# Altium project ife18_TS_BMS_LTC6813_v2.PrjPcb
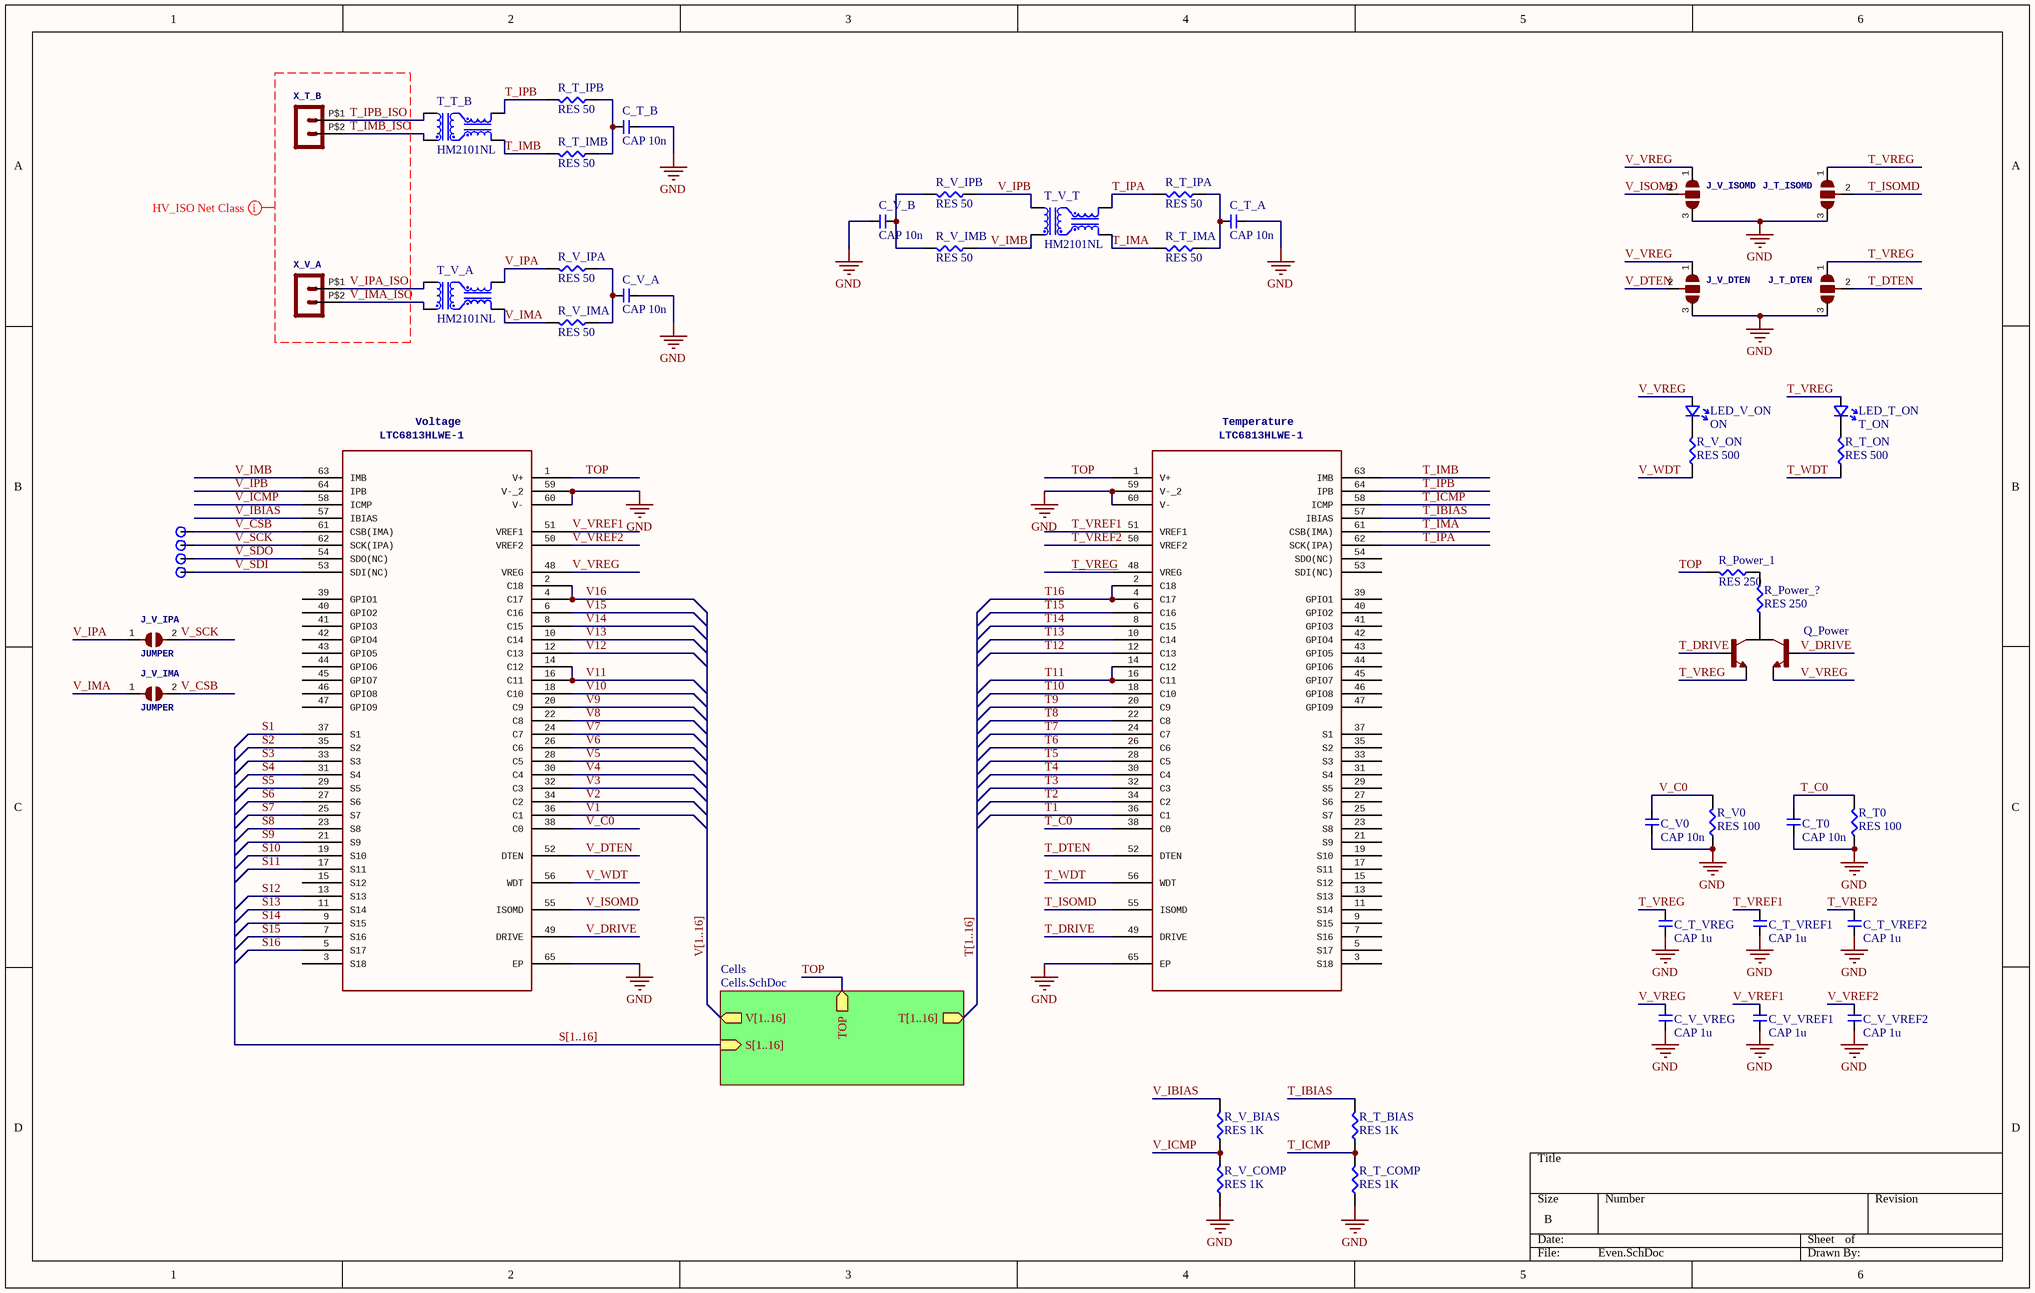
[diagram p0: Even.SchDoc]
3 sheets, 242 parts. Net scope: hierarchical (ports join the sheet entries above them; power ports are global).
Board file: ife18_TS_BMS_LTC6813_v2.PcbDoc
Sheets:
  Even.SchDoc
    Cells = Cells.SchDoc
      CELL1 = Cell.SchDoc
      CELL2 = Cell.SchDoc
      CELL3 = Cell.SchDoc
      CELL4 = Cell.SchDoc
      CELL5 = Cell.SchDoc
      CELL6 = Cell.SchDoc
      CELL7 = Cell.SchDoc
      CELL8 = Cell.SchDoc
      CELL9 = Cell.SchDoc
      CELL10 = Cell.SchDoc
      CELL11 = Cell.SchDoc
      CELL12 = Cell.SchDoc
      CELL13 = Cell.SchDoc
      CELL14 = Cell.SchDoc
      CELL15 = Cell.SchDoc
      CELL16 = Cell.SchDoc

## Sheet Even.SchDoc
size B

### Parts
C_T0  CAP 10n  [CAP-0603]
C_T_A  CAP 10n  [CAP-0603]
C_T_B  CAP 10n  [CAP-0603]
C_T_VREF1  CAP 1u  [CAP-0603]
C_T_VREF2  CAP 1u  [CAP-0603]
C_T_VREG  CAP 1u  [CAP-0603]
C_V0  CAP 10n  [CAP-0603]
C_V_A  CAP 10n  [CAP-0603]
C_V_B  CAP 10n  [CAP-0603]
C_V_VREF1  CAP 1u  [CAP-0603]
C_V_VREF2  CAP 1u  [CAP-0603]
C_V_VREG  CAP 1u  [CAP-0603]
J_T_DTEN  (no value)  [SJ_2]
J_T_ISOMD  (no value)  [SJ_2]
J_V_DTEN  (no value)  [SJ_2]
J_V_IMA  JUMPER  [SJ]
J_V_IPA  JUMPER  [SJ]
J_V_ISOMD  (no value)  [SJ_2]
LED_T_ON  T_ON  [LED-0603]
LED_V_ON  ON  [LED-0603]
Q_Power  (no value)  [LFPAK56D]
R_Power_1  RES 250  [RES-2512]
R_Power_?  RES 250  [RES-2512]
R_T0  RES 100  [RES-0603]
R_T_BIAS  RES 1K  [RES-0603]
R_T_COMP  RES 1K  [RES-0603]
R_T_IMA  RES 50  [RES-0603]
R_T_IMB  RES 50  [RES-0603]
R_T_IPA  RES 50  [RES-0603]
R_T_IPB  RES 50  [RES-0603]
R_T_ON  RES 500  [RES-0603]
R_V0  RES 100  [RES-0603]
R_V_BIAS  RES 1K  [RES-0603]
R_V_COMP  RES 1K  [RES-0603]
R_V_IMA  RES 50  [RES-0603]
R_V_IMB  RES 50  [RES-0603]
R_V_IPA  RES 50  [RES-0603]
R_V_IPB  RES 50  [RES-0603]
R_V_ON  RES 500  [RES-0603]
T_T_B  HM2101NL  [HM2101]
T_V_A  HM2101NL  [HM2101]
T_V_T  HM2101NL  [HM2101]
Temperature  LTC6813HLWE-1  [LQFP64_LWE_A]
TP_CSB  S  [Testpoint]  (value not drawn)
TP_SCK  C  [Testpoint]  (value not drawn)
TP_SDI  I  [Testpoint]  (value not drawn)
TP_SDO  O  [Testpoint]  (value not drawn)
Voltage  LTC6813HLWE-1  [LQFP64_LWE_A]
X_T_B  Molex - Micro-Fit 3.0 Series connector,  3.00mm (0.118") pitch header, 2 positions.  [43650-0224]  (value not drawn)
X_V_A  Molex - Micro-Fit 3.0 Series connector,  3.00mm (0.118") pitch header, 2 positions.  [43650-0224]  (value not drawn)

### Sub-sheets
Cells = Cells.SchDoc: S[1..16] (in), V[1..16] (out), T[1..16] (out), TOP (out)

### Nets
GND: C_T0.1 C_T_A.1 C_T_B.1 C_T_VREF1.1 C_T_VREF2.1 C_T_VREG.1 C_V0.1 C_V_A.1 C_V_B.1 C_V_VREF1.1 C_V_VREF2.1 C_V_VREG.1 J_T_DTEN.3 J_T_ISOMD.3 J_V_DTEN.3 J_V_ISOMD.3 R_T0.1 R_T_COMP.1 R_V0.1 R_V_COMP.1 Temperature.59(V-_2) Temperature.60(V-) Temperature.65(EP) Voltage.59(V-_2) Voltage.60(V-) Voltage.65(EP)  [project net NEG]
S1: Voltage.37(S1)
S2: Voltage.35(S2)
S3: Voltage.33(S3)
S4: Voltage.31(S4)
S5: Voltage.29(S5)
S6: Voltage.27(S6)
S7: Voltage.25(S7)
S8: Voltage.23(S8)
S9: Voltage.21(S9)
S10: Voltage.19(S10)
S11: Voltage.17(S11)
S12: Voltage.13(S13)
S13: Voltage.11(S14)
S14: Voltage.9(S15)
S15: Voltage.7(S16)
S16: Voltage.5(S17)
T1: Temperature.36(C1)
T2: Temperature.34(C2)
T3: Temperature.32(C3)
T4: Temperature.30(C4)
T5: Temperature.28(C5)
T6: Temperature.26(C6)
T7: Temperature.24(C7)
T8: Temperature.22(C8)
T9: Temperature.20(C9)
T10: Temperature.18(C10)
T11: Temperature.14(C12) Temperature.16(C11)
T12: Temperature.12(C13)
T13: Temperature.10(C14)
T14: Temperature.8(C15)
T15: Temperature.6(C16)
T16: Temperature.2(C18) Temperature.4(C17)
T_C0: C_T0.2 R_T0.2 Temperature.38(C0)
T_DRIVE: Q_Power.B1(B) Temperature.49(DRIVE)
T_DTEN: J_T_DTEN.2 Temperature.52(DTEN)
T_IBIAS: R_T_BIAS.2 Temperature.57(IBIAS)
T_ICMP: R_T_BIAS.1 R_T_COMP.2 Temperature.58(ICMP)
T_IMA: R_T_IMA.2 T_V_T.4 Temperature.61(CSB(IMA))
T_IMB: R_T_IMB.2 T_T_B.4 Temperature.63(IMB)
T_IMB_ISO: T_T_B.3 X_T_B.P$2
T_IPA: R_T_IPA.2 T_V_T.6 Temperature.62(SCK(IPA))
T_IPB: R_T_IPB.2 T_T_B.6 Temperature.64(IPB)
T_IPB_ISO: T_T_B.1 X_T_B.P$1
T_ISOMD: J_T_ISOMD.2 Temperature.55(ISOMD)
T_VREF1: C_T_VREF1.2 Temperature.51(VREF1)
T_VREF2: C_T_VREF2.2 Temperature.50(VREF2)
T_VREG: C_T_VREG.2 J_T_DTEN.1 J_T_ISOMD.1 LED_T_ON.A Q_Power.E1(E) Temperature.48(VREG)
T_WDT: R_T_ON.1 Temperature.56(WDT)
TOP: R_Power_1.2 Temperature.1(V+) Voltage.1(V+) ; sheet Cells/TOP  [project net POS16]
V1: Voltage.36(C1)
V2: Voltage.34(C2)
V3: Voltage.32(C3)
V4: Voltage.30(C4)
V5: Voltage.28(C5)
V6: Voltage.26(C6)
V7: Voltage.24(C7)
V8: Voltage.22(C8)
V9: Voltage.20(C9)
V10: Voltage.18(C10)
V11: Voltage.14(C12) Voltage.16(C11)
V12: Voltage.12(C13)
V13: Voltage.10(C14)
V14: Voltage.8(C15)
V15: Voltage.6(C16)
V16: Voltage.2(C18) Voltage.4(C17)
V_C0: C_V0.2 R_V0.2 Voltage.38(C0)
V_CSB: J_V_IMA.2 TP_CSB.1 Voltage.61(CSB(IMA))
V_DRIVE: Q_Power.B2(B) Voltage.49(DRIVE)
V_DTEN: J_V_DTEN.2 Voltage.52(DTEN)
V_IBIAS: R_V_BIAS.2 Voltage.57(IBIAS)
V_ICMP: R_V_BIAS.1 R_V_COMP.2 Voltage.58(ICMP)
V_IMA: J_V_IMA.1 R_V_IMA.2 T_V_A.4
V_IMA_ISO: T_V_A.3 X_V_A.P$2
V_IMB: R_V_IMB.2 T_V_T.3 Voltage.63(IMB)
V_IPA: J_V_IPA.1 R_V_IPA.2 T_V_A.6
V_IPA_ISO: T_V_A.1 X_V_A.P$1
V_IPB: R_V_IPB.2 T_V_T.1 Voltage.64(IPB)
V_ISOMD: J_V_ISOMD.2 Voltage.55(ISOMD)
V_SCK: J_V_IPA.2 TP_SCK.1 Voltage.62(SCK(IPA))
V_SDI: TP_SDI.1 Voltage.53(SDI(NC))
V_SDO: TP_SDO.1 Voltage.54(SDO(NC))
V_VREF1: C_V_VREF1.2 Voltage.51(VREF1)
V_VREF2: C_V_VREF2.2 Voltage.50(VREF2)
V_VREG: C_V_VREG.2 J_V_DTEN.1 J_V_ISOMD.1 LED_V_ON.A Q_Power.E2(E) Voltage.48(VREG)
V_WDT: R_V_ON.1 Voltage.56(WDT)
NetC_T_A_2: C_T_A.2 R_T_IMA.1 R_T_IPA.1
NetC_T_B_2: C_T_B.2 R_T_IMB.1 R_T_IPB.1
NetC_V_A_2: C_V_A.2 R_V_IMA.1 R_V_IPA.1
NetC_V_B_2: C_V_B.2 R_V_IMB.1 R_V_IPB.1
NetLED_T_ON_K: LED_T_ON.K R_T_ON.2
NetLED_V_ON_K: LED_V_ON.K R_V_ON.2
NetQ_Power_C: Q_Power.C R_Power_?.1
NetR_Power_1_1: R_Power_1.1 R_Power_?.2

Not connected (* = marked no-connect by the designer): Temperature 3(S18) 5(S17) 7(S16) 9(S15) 11(S14) 13(S13) 15(S12) 17(S11) 19(S10) 21(S9) 23(S8) 25(S7) 27(S6) 29(S5) 31(S4) 33(S3) 35(S2) 37(S1) 39(GPIO1) 40(GPIO2) 41(GPIO3) 42(GPIO4) 43(GPIO5) 44(GPIO6) 45(GPIO7) 46(GPIO8) 47(GPIO9) 53(SDI(NC)) 54(SDO(NC)); Voltage 3(S18) 15(S12) 39(GPIO1) 40(GPIO2) 41(GPIO3) 42(GPIO4) 43(GPIO5) 44(GPIO6) 45(GPIO7) 46(GPIO8) 47(GPIO9)

### Buses and harness runs
bus S[1..16] = sheet Cells/S[1..16]
bus T[1..16] = sheet Cells/T[1..16]
bus V[1..16] = sheet Cells/V[1..16]

### Layout directives
net class HV_ISO: T_IMB_ISO, T_IPB_ISO, V_IMA_ISO, V_IPA_ISO

### Library data of the parts
C_T0 C_T_A C_T_B C_T_VREF1 C_T_VREF2 C_T_VREG C_V0 C_V_A C_V_B C_V_VREF1 C_V_VREF2 C_V_VREG = CAP-0603
J_T_DTEN J_T_ISOMD J_V_DTEN J_V_ISOMD = JUMPER_2W: GateName_1: G$1; SymbolName_1: SJ_2; LibraryName: IFE_Jumpers; DeviceSetName: JUMPER_2W; Package: SJ_2
J_V_IMA J_V_IPA = JUMPER: GateName_1: G$1; SymbolName_1: SJ; LibraryName: IFE_Jumpers; DeviceSetName: JUMPER; Package: SJ
LED_T_ON LED_V_ON = LED-0603
Q_Power = PHPT610030NK
R_Power_1 R_Power_? = RES-2512
R_T0 R_T_BIAS R_T_COMP R_T_IMA R_T_IMB R_T_IPA R_T_IPB R_T_ON R_V0 R_V_BIAS R_V_COMP R_V_IMA R_V_IMB R_V_IPA R_V_IPB R_V_ON = RES-0603
Temperature Voltage = LTC6813HLWE-1: GateName_1: A; SymbolName_1: LTC6813XLWE-1; LibraryName: LTC6813_Official; DeviceSetName: LTC6813HLWE-1; Package: LQFP64_LWE_A
TP_CSB TP_SCK TP_SDI TP_SDO = Testpoint
X_T_B X_V_A = HEADER_POS2_?43650-0224: GateName_1: G$1; SymbolName_1: HEADER_POS2; DeviceName: 43650-0224; LibraryName: MOLEX Micro-Fit; DeviceSetName: HEADER_POS2_?; Package: 43650-0224

## Sheet Cells.SchDoc
size 190 x 114 mm
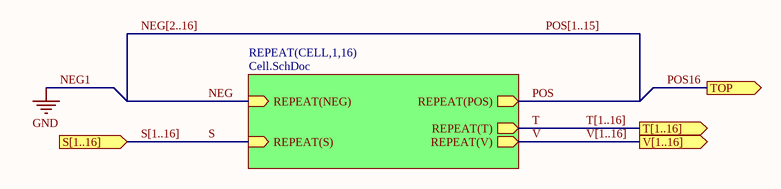
[diagram p1: Cells.SchDoc]

### Sub-sheets
REPEAT(CELL,1,16) = Cell.SchDoc: REPEAT(NEG) (in), REPEAT(POS) (out), REPEAT(T) (out), REPEAT(V) (out), REPEAT(S) (in)

### Ports
S[1..16] (in), T[1..16] (out), TOP (out), V[1..16] (out)

### Buses and harness runs
bus NEG[2..16] = POS[1..15]
bus S[1..16] = port S[1..16]
bus T[1..16] = port T[1..16]
bus V[1..16] = port V[1..16]

## Sheet Cell.SchDoc
size 152 x 88 mm
Used 16 times, as channels Cells/CELL1, Cells/CELL2, Cells/CELL3, Cells/CELL4, Cells/CELL5, Cells/CELL6, Cells/CELL7, Cells/CELL8, Cells/CELL9, Cells/CELL10, Cells/CELL11, Cells/CELL12, Cells/CELL13, Cells/CELL14, Cells/CELL15, Cells/CELL16. Parts and nets are listed once, with the designators drawn on the sheet.
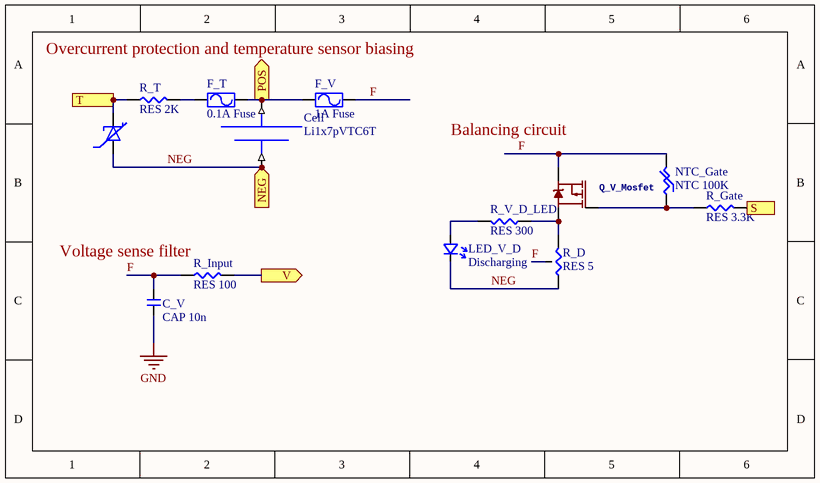
[diagram p2: Cell.SchDoc]

### Parts
C_V  CAP 10n  [CAP-0603]
Cell  Li1x7pVTC6T  [Li1x7pVTC6T]
F_T  0.1A Fuse  [2410SMD]
F_V  1A Fuse  [2410SMD]
LED_V_D  Discharging  [LED-0603]
NTC_Gate  NTC 100K  [NTC-0603]
Q_V_Mosfet  (no value)  [TO252]
R_D  RES 5  [TO252-TKH-45]
R_Gate  RES 3.3K  [RES-0603]
R_Input  RES 100  [RES-0603]
R_T  RES 2K  [RES-0603]
R_V_D_LED  RES 300  [RES-0603]

### Ports
NEG (in), POS (out), S (in), T (out), V (out)

### Nets
GND: C_V.1
F: C_V.2 F_V.1 NTC_Gate.2 Q_V_Mosfet.3(S) R_D.3 R_Input.1
NEG: Cell.- Cell.T- LED_V_D.K R_D.1 ; port NEG
POS: Cell.+ F_T.1 F_V.2 ; port POS
S: R_Gate.2 ; port S
T: Cell.T+ R_T.1 ; port T
V: R_Input.2 ; port V
NetF_T_2: F_T.2 R_T.2
NetLED_V_D_A: LED_V_D.A R_V_D_LED.2
NetNTC_Gate_1: NTC_Gate.1 Q_V_Mosfet.1(G) R_Gate.1
NetQ_V_Mosfet_2: Q_V_Mosfet.2(D) R_D.2 R_V_D_LED.1

### Channels
Cells/CELL1: designators end in _CELL1; ports NEG=NEG POS=NEG S=S1 T=T1 V=V1
Cells/CELL2: designators end in _CELL2; ports NEG=NEG POS=NEG S=S2 T=T2 V=V2
Cells/CELL3: designators end in _CELL3; ports NEG=NEG POS=NEG S=S3 T=T3 V=V3
Cells/CELL4: designators end in _CELL4; ports NEG=NEG POS=NEG S=S4 T=T4 V=V4
Cells/CELL5: designators end in _CELL5; ports NEG=NEG POS=NEG S=S5 T=T5 V=V5
Cells/CELL6: designators end in _CELL6; ports NEG=NEG POS=NEG S=S6 T=T6 V=V6
Cells/CELL7: designators end in _CELL7; ports NEG=NEG POS=NEG S=S7 T=T7 V=V7
Cells/CELL8: designators end in _CELL8; ports NEG=NEG POS=NEG S=S8 T=T8 V=V8
Cells/CELL9: designators end in _CELL9; ports NEG=NEG POS=NEG S=S9 T=T9 V=V9
Cells/CELL10: designators end in _CELL10; ports NEG=NEG POS=NEG S=S10 T=T10 V=V10
Cells/CELL11: designators end in _CELL11; ports NEG=NEG POS=NEG S=S11 T=T11 V=V11
Cells/CELL12: designators end in _CELL12; ports NEG=NEG POS=NEG S=S12 T=T12 V=V12
Cells/CELL13: designators end in _CELL13; ports NEG=NEG POS=NEG S=S13 T=T13 V=V13
Cells/CELL14: designators end in _CELL14; ports NEG=NEG POS=NEG S=S14 T=T14 V=V14
Cells/CELL15: designators end in _CELL15; ports NEG=NEG POS=NEG S=S15 T=T15 V=V15
Cells/CELL16: designators end in _CELL16; ports NEG=NEG POS=POS16 S=S16 T=T16 V=V16

### Notes on the sheet
- Overcurrent protection and temperature sensor biasing
- (near Q_V_Mosfet) Balancing circuit
- (near R_Input) Voltage sense filter

### Library data of the parts
C_V = CAP-0603
F_T F_V = 0679L
LED_V_D = LED-0603
NTC_Gate = NTC-0603
Q_V_Mosfet = DMP10H400SK3-13: GateName_1: G$1; SymbolName_1: LABELED-PMOS; LibraryName: IFE_Transistors; DeviceSetName: DMP10H400SK3-13; Package: TO252
R_D = TKH45
R_Gate R_Input R_T R_V_D_LED = RES-0603

## Nets that join several sheets
NEG: Even (26 pins), Cells/CELL1 (5 pins), Cells/CELL2 (C_V_CELL2.1), Cells/CELL3 (C_V_CELL3.1), Cells/CELL4 (C_V_CELL4.1), Cells/CELL5 (C_V_CELL5.1), Cells/CELL6 (C_V_CELL6.1), Cells/CELL7 (C_V_CELL7.1), Cells/CELL8 (C_V_CELL8.1), Cells/CELL9 (C_V_CELL9.1), Cells/CELL10 (C_V_CELL10.1), Cells/CELL11 (C_V_CELL11.1), Cells/CELL12 (C_V_CELL12.1), Cells/CELL13 (C_V_CELL13.1), Cells/CELL14 (C_V_CELL14.1), Cells/CELL15 (C_V_CELL15.1), Cells/CELL16 (C_V_CELL16.1)
NEG: Cells/CELL1 (Cell_CELL1.+ F_T_CELL1.1 F_V_CELL1.2), Cells/CELL2 (Cell_CELL2.- Cell_CELL2.T- LED_V_D_CELL2.K R_D_CELL2.1)
NEG: Cells/CELL2 (Cell_CELL2.+ F_T_CELL2.1 F_V_CELL2.2), Cells/CELL3 (Cell_CELL3.- Cell_CELL3.T- LED_V_D_CELL3.K R_D_CELL3.1)
NEG: Cells/CELL3 (Cell_CELL3.+ F_T_CELL3.1 F_V_CELL3.2), Cells/CELL4 (Cell_CELL4.- Cell_CELL4.T- LED_V_D_CELL4.K R_D_CELL4.1)
NEG: Cells/CELL4 (Cell_CELL4.+ F_T_CELL4.1 F_V_CELL4.2), Cells/CELL5 (Cell_CELL5.- Cell_CELL5.T- LED_V_D_CELL5.K R_D_CELL5.1)
NEG: Cells/CELL5 (Cell_CELL5.+ F_T_CELL5.1 F_V_CELL5.2), Cells/CELL6 (Cell_CELL6.- Cell_CELL6.T- LED_V_D_CELL6.K R_D_CELL6.1)
NEG: Cells/CELL6 (Cell_CELL6.+ F_T_CELL6.1 F_V_CELL6.2), Cells/CELL7 (Cell_CELL7.- Cell_CELL7.T- LED_V_D_CELL7.K R_D_CELL7.1)
NEG: Cells/CELL7 (Cell_CELL7.+ F_T_CELL7.1 F_V_CELL7.2), Cells/CELL8 (Cell_CELL8.- Cell_CELL8.T- LED_V_D_CELL8.K R_D_CELL8.1)
NEG: Cells/CELL8 (Cell_CELL8.+ F_T_CELL8.1 F_V_CELL8.2), Cells/CELL9 (Cell_CELL9.- Cell_CELL9.T- LED_V_D_CELL9.K R_D_CELL9.1)
NEG: Cells/CELL9 (Cell_CELL9.+ F_T_CELL9.1 F_V_CELL9.2), Cells/CELL10 (Cell_CELL10.- Cell_CELL10.T- LED_V_D_CELL10.K R_D_CELL10.1)
NEG: Cells/CELL10 (Cell_CELL10.+ F_T_CELL10.1 F_V_CELL10.2), Cells/CELL11 (Cell_CELL11.- Cell_CELL11.T- LED_V_D_CELL11.K R_D_CELL11.1)
NEG: Cells/CELL11 (Cell_CELL11.+ F_T_CELL11.1 F_V_CELL11.2), Cells/CELL12 (Cell_CELL12.- Cell_CELL12.T- LED_V_D_CELL12.K R_D_CELL12.1)
NEG: Cells/CELL12 (Cell_CELL12.+ F_T_CELL12.1 F_V_CELL12.2), Cells/CELL13 (Cell_CELL13.- Cell_CELL13.T- LED_V_D_CELL13.K R_D_CELL13.1)
NEG: Cells/CELL13 (Cell_CELL13.+ F_T_CELL13.1 F_V_CELL13.2), Cells/CELL14 (Cell_CELL14.- Cell_CELL14.T- LED_V_D_CELL14.K R_D_CELL14.1)
NEG: Cells/CELL14 (Cell_CELL14.+ F_T_CELL14.1 F_V_CELL14.2), Cells/CELL15 (Cell_CELL15.- Cell_CELL15.T- LED_V_D_CELL15.K R_D_CELL15.1)
NEG: Cells/CELL15 (Cell_CELL15.+ F_T_CELL15.1 F_V_CELL15.2), Cells/CELL16 (Cell_CELL16.- Cell_CELL16.T- LED_V_D_CELL16.K R_D_CELL16.1)
POS16: Even (R_Power_1.2 Temperature.1 Voltage.1), Cells/CELL16 (Cell_CELL16.+ F_T_CELL16.1 F_V_CELL16.2)
S1: Even (Voltage.37), Cells/CELL1 (R_Gate_CELL1.2)
S2: Even (Voltage.35), Cells/CELL2 (R_Gate_CELL2.2)
S3: Even (Voltage.33), Cells/CELL3 (R_Gate_CELL3.2)
S4: Even (Voltage.31), Cells/CELL4 (R_Gate_CELL4.2)
S5: Even (Voltage.29), Cells/CELL5 (R_Gate_CELL5.2)
S6: Even (Voltage.27), Cells/CELL6 (R_Gate_CELL6.2)
S7: Even (Voltage.25), Cells/CELL7 (R_Gate_CELL7.2)
S8: Even (Voltage.23), Cells/CELL8 (R_Gate_CELL8.2)
S9: Even (Voltage.21), Cells/CELL9 (R_Gate_CELL9.2)
S10: Even (Voltage.19), Cells/CELL10 (R_Gate_CELL10.2)
S11: Even (Voltage.17), Cells/CELL11 (R_Gate_CELL11.2)
S12: Even (Voltage.13), Cells/CELL12 (R_Gate_CELL12.2)
S13: Even (Voltage.11), Cells/CELL13 (R_Gate_CELL13.2)
S14: Even (Voltage.9), Cells/CELL14 (R_Gate_CELL14.2)
S15: Even (Voltage.7), Cells/CELL15 (R_Gate_CELL15.2)
S16: Even (Voltage.5), Cells/CELL16 (R_Gate_CELL16.2)
T1: Even (Temperature.36), Cells/CELL1 (Cell_CELL1.T+ R_T_CELL1.1)
T2: Even (Temperature.34), Cells/CELL2 (Cell_CELL2.T+ R_T_CELL2.1)
T3: Even (Temperature.32), Cells/CELL3 (Cell_CELL3.T+ R_T_CELL3.1)
T4: Even (Temperature.30), Cells/CELL4 (Cell_CELL4.T+ R_T_CELL4.1)
T5: Even (Temperature.28), Cells/CELL5 (Cell_CELL5.T+ R_T_CELL5.1)
T6: Even (Temperature.26), Cells/CELL6 (Cell_CELL6.T+ R_T_CELL6.1)
T7: Even (Temperature.24), Cells/CELL7 (Cell_CELL7.T+ R_T_CELL7.1)
T8: Even (Temperature.22), Cells/CELL8 (Cell_CELL8.T+ R_T_CELL8.1)
T9: Even (Temperature.20), Cells/CELL9 (Cell_CELL9.T+ R_T_CELL9.1)
T10: Even (Temperature.18), Cells/CELL10 (Cell_CELL10.T+ R_T_CELL10.1)
T11: Even (Temperature.14 Temperature.16), Cells/CELL11 (Cell_CELL11.T+ R_T_CELL11.1)
T12: Even (Temperature.12), Cells/CELL12 (Cell_CELL12.T+ R_T_CELL12.1)
T13: Even (Temperature.10), Cells/CELL13 (Cell_CELL13.T+ R_T_CELL13.1)
T14: Even (Temperature.8), Cells/CELL14 (Cell_CELL14.T+ R_T_CELL14.1)
T15: Even (Temperature.6), Cells/CELL15 (Cell_CELL15.T+ R_T_CELL15.1)
T16: Even (Temperature.2 Temperature.4), Cells/CELL16 (Cell_CELL16.T+ R_T_CELL16.1)
V1: Even (Voltage.36), Cells/CELL1 (R_Input_CELL1.2)
V2: Even (Voltage.34), Cells/CELL2 (R_Input_CELL2.2)
V3: Even (Voltage.32), Cells/CELL3 (R_Input_CELL3.2)
V4: Even (Voltage.30), Cells/CELL4 (R_Input_CELL4.2)
V5: Even (Voltage.28), Cells/CELL5 (R_Input_CELL5.2)
V6: Even (Voltage.26), Cells/CELL6 (R_Input_CELL6.2)
V7: Even (Voltage.24), Cells/CELL7 (R_Input_CELL7.2)
V8: Even (Voltage.22), Cells/CELL8 (R_Input_CELL8.2)
V9: Even (Voltage.20), Cells/CELL9 (R_Input_CELL9.2)
V10: Even (Voltage.18), Cells/CELL10 (R_Input_CELL10.2)
V11: Even (Voltage.14 Voltage.16), Cells/CELL11 (R_Input_CELL11.2)
V12: Even (Voltage.12), Cells/CELL12 (R_Input_CELL12.2)
V13: Even (Voltage.10), Cells/CELL13 (R_Input_CELL13.2)
V14: Even (Voltage.8), Cells/CELL14 (R_Input_CELL14.2)
V15: Even (Voltage.6), Cells/CELL15 (R_Input_CELL15.2)
V16: Even (Voltage.2 Voltage.4), Cells/CELL16 (R_Input_CELL16.2)